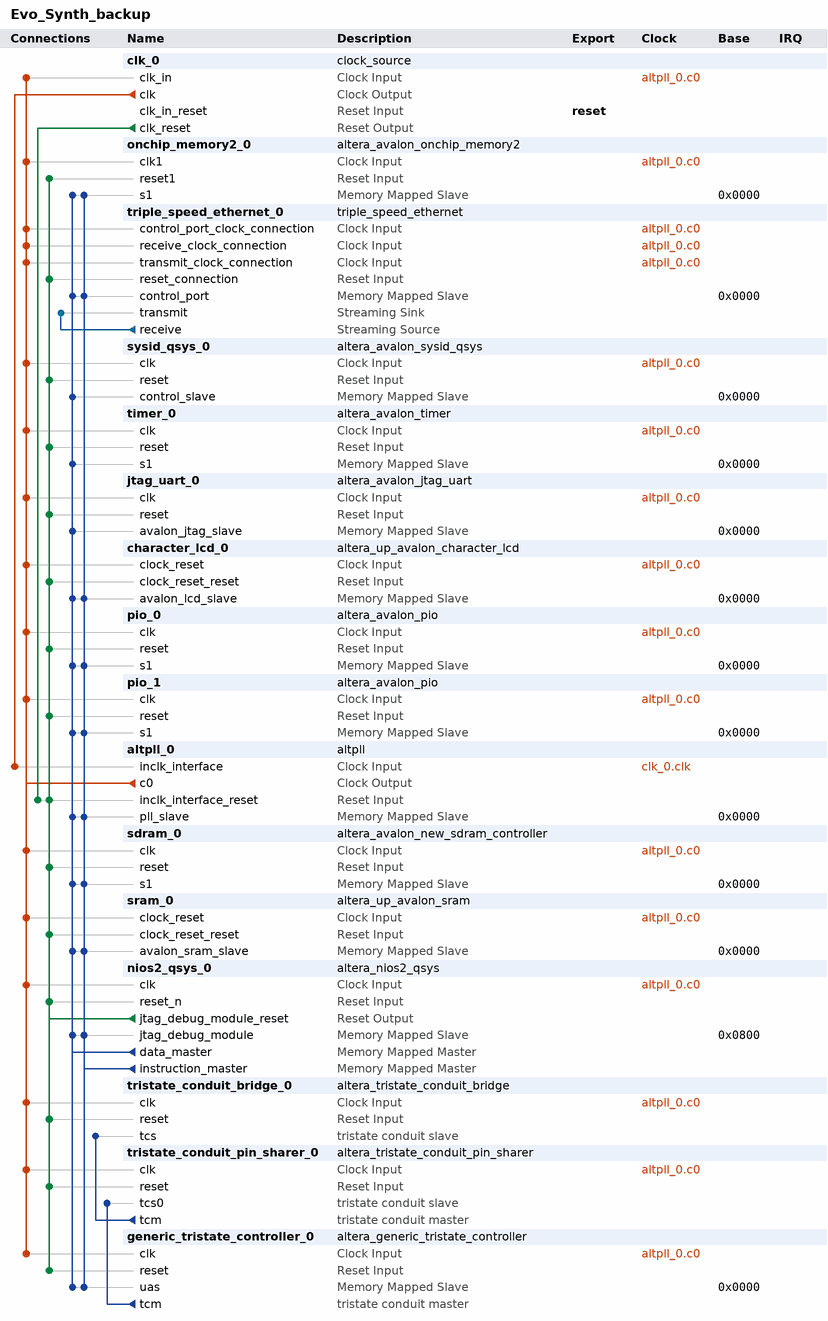
[diagram p0: system contents]
# Platform Designer (Qsys) system Evo_Synth_backup, Cyclone II EP2C35F672C6
# Parameters at their usual value, and those the tool derives, are not listed.
package require -exact qsys 12.1
create_system Evo_Synth_backup
set_project_property DEVICE_FAMILY {Cyclone II}
set_project_property DEVICE EP2C35F672C6

add_instance clk_0 clock_source 12.1
set_instance_parameter_value clk_0 clockFrequency 50000000

add_instance onchip_memory2_0 altera_avalon_onchip_memory2 12.1
set_instance_parameter_value onchip_memory2_0 dataWidth 32
set_instance_parameter_value onchip_memory2_0 dualPort false
set_instance_parameter_value onchip_memory2_0 initMemContent true
set_instance_parameter_value onchip_memory2_0 initializationFileName onchip_memory2_0
set_instance_parameter_value onchip_memory2_0 memorySize 16384

add_instance triple_speed_ethernet_0 triple_speed_ethernet 12.1
set_instance_parameter_value triple_speed_ethernet_0 atlanticSinkClockRate 0
set_instance_parameter_value triple_speed_ethernet_0 atlanticSinkClockSource unassigned
set_instance_parameter_value triple_speed_ethernet_0 atlanticSourceClockRate 0
set_instance_parameter_value triple_speed_ethernet_0 atlanticSourceClockSource unassigned
set_instance_parameter_value triple_speed_ethernet_0 avalonSlaveClockRate 0
set_instance_parameter_value triple_speed_ethernet_0 avalonSlaveClockSource unassigned
set_instance_parameter_value triple_speed_ethernet_0 avalonStNeighbours {unassigned=unassigned}
set_instance_parameter_value triple_speed_ethernet_0 channel_count 1
set_instance_parameter_value triple_speed_ethernet_0 core_variation MAC_ONLY
set_instance_parameter_value triple_speed_ethernet_0 core_version 3073
set_instance_parameter_value triple_speed_ethernet_0 crc32check16bit 0
set_instance_parameter_value triple_speed_ethernet_0 crc32dwidth 8
set_instance_parameter_value triple_speed_ethernet_0 crc32gendelay 6
set_instance_parameter_value triple_speed_ethernet_0 crc32s1l2_extern false
set_instance_parameter_value triple_speed_ethernet_0 cust_version 0
set_instance_parameter_value triple_speed_ethernet_0 dataBitsPerSymbol 8
set_instance_parameter_value triple_speed_ethernet_0 dev_version 3073
set_instance_parameter_value triple_speed_ethernet_0 eg_addr 6
set_instance_parameter_value triple_speed_ethernet_0 ena_hash false
set_instance_parameter_value triple_speed_ethernet_0 enable_alt_reconfig false
set_instance_parameter_value triple_speed_ethernet_0 enable_clk_sharing false
set_instance_parameter_value triple_speed_ethernet_0 enable_ena 32
set_instance_parameter_value triple_speed_ethernet_0 enable_fifoless false
set_instance_parameter_value triple_speed_ethernet_0 enable_gmii_loopback false
set_instance_parameter_value triple_speed_ethernet_0 enable_hd_logic true
set_instance_parameter_value triple_speed_ethernet_0 enable_mac_flow_ctrl false
set_instance_parameter_value triple_speed_ethernet_0 enable_mac_txaddr_set true
set_instance_parameter_value triple_speed_ethernet_0 enable_mac_vlan false
set_instance_parameter_value triple_speed_ethernet_0 enable_maclite false
set_instance_parameter_value triple_speed_ethernet_0 enable_magic_detect true
set_instance_parameter_value triple_speed_ethernet_0 enable_multi_channel false
set_instance_parameter_value triple_speed_ethernet_0 enable_pkt_class true
set_instance_parameter_value triple_speed_ethernet_0 enable_pma false
set_instance_parameter_value triple_speed_ethernet_0 enable_ptp_1step false
set_instance_parameter_value triple_speed_ethernet_0 enable_reg_sharing false
set_instance_parameter_value triple_speed_ethernet_0 enable_sgmii false
set_instance_parameter_value triple_speed_ethernet_0 enable_shift16 true
set_instance_parameter_value triple_speed_ethernet_0 enable_sup_addr false
set_instance_parameter_value triple_speed_ethernet_0 enable_timestamping false
set_instance_parameter_value triple_speed_ethernet_0 enable_use_internal_fifo true
set_instance_parameter_value triple_speed_ethernet_0 export_calblkclk false
set_instance_parameter_value triple_speed_ethernet_0 export_pwrdn false
set_instance_parameter_value triple_speed_ethernet_0 ext_stat_cnt_ena false
set_instance_parameter_value triple_speed_ethernet_0 gigeAdvanceMode true
set_instance_parameter_value triple_speed_ethernet_0 ifGMII MII_GMII
set_instance_parameter_value triple_speed_ethernet_0 ifPCSuseEmbeddedSerdes false
set_instance_parameter_value triple_speed_ethernet_0 ing_addr 11
set_instance_parameter_value triple_speed_ethernet_0 insert_ta true
set_instance_parameter_value triple_speed_ethernet_0 maclite_gige false
set_instance_parameter_value triple_speed_ethernet_0 max_channels 1
set_instance_parameter_value triple_speed_ethernet_0 mdio_clk_div 40
set_instance_parameter_value triple_speed_ethernet_0 phy_identifier 0
set_instance_parameter_value triple_speed_ethernet_0 ramType AUTO
set_instance_parameter_value triple_speed_ethernet_0 reset_level 1
set_instance_parameter_value triple_speed_ethernet_0 starting_channel_number 0
set_instance_parameter_value triple_speed_ethernet_0 stat_cnt_ena true
set_instance_parameter_value triple_speed_ethernet_0 timingAdapterName timingAdapter
set_instance_parameter_value triple_speed_ethernet_0 toolContext SOPC_BUILDER
set_instance_parameter_value triple_speed_ethernet_0 transceiver_type GXB
set_instance_parameter_value triple_speed_ethernet_0 tstamp_fp_width 4
set_instance_parameter_value triple_speed_ethernet_0 uiHostClockFrequency 0
set_instance_parameter_value triple_speed_ethernet_0 uiMDIOFreq {3 MHz}
set_instance_parameter_value triple_speed_ethernet_0 useLvds false
set_instance_parameter_value triple_speed_ethernet_0 useMAC true
set_instance_parameter_value triple_speed_ethernet_0 useMDIO false
set_instance_parameter_value triple_speed_ethernet_0 usePCS false
set_instance_parameter_value triple_speed_ethernet_0 use_sync_reset true

add_instance sysid_qsys_0 altera_avalon_sysid_qsys 12.1
set_instance_parameter_value sysid_qsys_0 id 0

add_instance timer_0 altera_avalon_timer 12.1
set_instance_parameter_value timer_0 period 1
set_instance_parameter_value timer_0 periodUnits MSEC
set_instance_parameter_value timer_0 timerPreset CUSTOM

add_instance jtag_uart_0 altera_avalon_jtag_uart 12.1
set_instance_parameter_value jtag_uart_0 simInteractiveOptions INTERACTIVE_INPUT_OUTPUT

add_instance character_lcd_0 altera_up_avalon_character_lcd 12.0
set_instance_parameter_value character_lcd_0 cursor Normal

add_instance pio_0 altera_avalon_pio 12.1
set_instance_parameter_value pio_0 direction Output
set_instance_parameter_value pio_0 width 8

add_instance pio_1 altera_avalon_pio 12.1
set_instance_parameter_value pio_1 direction Output
set_instance_parameter_value pio_1 width 8

add_instance altpll_0 altpll 12.1
set_instance_parameter_value altpll_0 INCLK0_INPUT_FREQUENCY 20000
set_instance_parameter_value altpll_0 GATE_LOCK_SIGNAL NO
set_instance_parameter_value altpll_0 VALID_LOCK_MULTIPLIER 1
set_instance_parameter_value altpll_0 INVALID_LOCK_MULTIPLIER 5
set_instance_parameter_value altpll_0 CLK0_MULTIPLY_BY 1
set_instance_parameter_value altpll_0 CLK0_DIVIDE_BY 1
set_instance_parameter_value altpll_0 PORT_clk1 PORT_UNUSED
set_instance_parameter_value altpll_0 PORT_clk2 PORT_UNUSED
set_instance_parameter_value altpll_0 PORT_clk3 PORT_UNUSED
set_instance_parameter_value altpll_0 PORT_ARESET PORT_UNUSED
set_instance_parameter_value altpll_0 PORT_LOCKED PORT_UNUSED

add_instance sdram_0 altera_avalon_new_sdram_controller 12.1
set_instance_parameter_value sdram_0 TAC 5.5
set_instance_parameter_value sdram_0 TRCD 20.0
set_instance_parameter_value sdram_0 TRP 20.0
set_instance_parameter_value sdram_0 casLatency 3
set_instance_parameter_value sdram_0 columnWidth 8
set_instance_parameter_value sdram_0 dataWidth 16
set_instance_parameter_value sdram_0 generateSimulationModel false
set_instance_parameter_value sdram_0 model custom
set_instance_parameter_value sdram_0 numberOfBanks 4
set_instance_parameter_value sdram_0 numberOfChipSelects 1
set_instance_parameter_value sdram_0 powerUpDelay 100.0
set_instance_parameter_value sdram_0 refreshPeriod 15.625
set_instance_parameter_value sdram_0 rowWidth 12

add_instance sram_0 altera_up_avalon_sram 12.0
set_instance_parameter_value sram_0 board DE2
set_instance_parameter_value sram_0 pixel_buffer false

add_instance nios2_qsys_0 altera_nios2_qsys 12.1
set_instance_parameter_value nios2_qsys_0 resetSlave generic_tristate_controller_0.uas
set_instance_parameter_value nios2_qsys_0 exceptionSlave None
set_instance_parameter_value nios2_qsys_0 breakSlave nios2_qsys_0.jtag_debug_module
set_instance_parameter_value nios2_qsys_0 impl Tiny
set_instance_parameter_value nios2_qsys_0 icache_size 4096

add_instance tristate_conduit_bridge_0 altera_tristate_conduit_bridge 12.1

add_instance tristate_conduit_pin_sharer_0 altera_tristate_conduit_pin_sharer 12.1
set_instance_parameter_value tristate_conduit_pin_sharer_0 NUM_INTERFACES 1
set_instance_parameter_value tristate_conduit_pin_sharer_0 MODULE_ORIGIN_LIST generic_tristate_controller_0.tcm,generic_tristate_controller_0.tcm,generic_tristate_controller_0.tcm,generic_tristate_controller_0.tcm,generic_tristate_controller_0.tcm

add_instance generic_tristate_controller_0 altera_generic_tristate_controller 12.1
set_instance_parameter_value generic_tristate_controller_0 TCM_ADDRESS_W 22
set_instance_parameter_value generic_tristate_controller_0 TCM_DATA_W 8
set_instance_parameter_value generic_tristate_controller_0 TCM_BYTEENABLE_W 1
set_instance_parameter_value generic_tristate_controller_0 TCM_READ_WAIT 160
set_instance_parameter_value generic_tristate_controller_0 TCM_WRITE_WAIT 160
set_instance_parameter_value generic_tristate_controller_0 TCM_SETUP_WAIT 40
set_instance_parameter_value generic_tristate_controller_0 TCM_DATA_HOLD 40
set_instance_parameter_value generic_tristate_controller_0 TCM_MAX_PENDING_READ_TRANSACTIONS 3
set_instance_parameter_value generic_tristate_controller_0 TCM_TURNAROUND_TIME 2
set_instance_parameter_value generic_tristate_controller_0 TCM_TIMING_UNITS 0
set_instance_parameter_value generic_tristate_controller_0 TCM_READLATENCY 2
set_instance_parameter_value generic_tristate_controller_0 TCM_SYMBOLS_PER_WORD 1
set_instance_parameter_value generic_tristate_controller_0 USE_READ 1
set_instance_parameter_value generic_tristate_controller_0 USE_BEGINTRANSFER 0
set_instance_parameter_value generic_tristate_controller_0 USE_BYTEENABLE 0
set_instance_parameter_value generic_tristate_controller_0 USE_OUTPUTENABLE 0
set_instance_parameter_value generic_tristate_controller_0 ACTIVE_LOW_READ 1
set_instance_parameter_value generic_tristate_controller_0 ACTIVE_LOW_BYTEENABLE 0
set_instance_parameter_value generic_tristate_controller_0 ACTIVE_LOW_OUTPUTENABLE 0
set_instance_parameter_value generic_tristate_controller_0 ACTIVE_LOW_BEGINTRANSFER 0
set_instance_parameter_value generic_tristate_controller_0 CHIPSELECT_THROUGH_READLATENCY 0
set_instance_parameter_value generic_tristate_controller_0 MODULE_ASSIGNMENT_KEYS embeddedsw.configuration.hwClassnameDriverSupportList,embeddedsw.configuration.isFlash,embeddedsw.configuration.isMemoryDevice,embeddedsw.configuration.isNonVolatileStorage
set_instance_parameter_value generic_tristate_controller_0 MODULE_ASSIGNMENT_VALUES "altera_avalon_lan91c111\\,altera_avalon_cfi_flash,1,1,1"
set_instance_parameter_value generic_tristate_controller_0 INTERFACE_ASSIGNMENT_KEYS embeddedsw.configuration.isFlash,embeddedsw.configuration.isMemoryDevice,embeddedsw.configuration.isNonVolatileStorage
set_instance_parameter_value generic_tristate_controller_0 INTERFACE_ASSIGNMENT_VALUES 1,1,1

# connections
add_connection altpll_0.c0 character_lcd_0.clock_reset clock
add_connection altpll_0.c0 clk_0.clk_in clock
add_connection altpll_0.c0 generic_tristate_controller_0.clk clock
add_connection altpll_0.c0 jtag_uart_0.clk clock
add_connection altpll_0.c0 nios2_qsys_0.clk clock
add_connection altpll_0.c0 onchip_memory2_0.clk1 clock
add_connection altpll_0.c0 pio_0.clk clock
add_connection altpll_0.c0 pio_1.clk clock
add_connection altpll_0.c0 sdram_0.clk clock
add_connection altpll_0.c0 sram_0.clock_reset clock
add_connection altpll_0.c0 sysid_qsys_0.clk clock
add_connection altpll_0.c0 timer_0.clk clock
add_connection altpll_0.c0 triple_speed_ethernet_0.control_port_clock_connection clock
add_connection altpll_0.c0 triple_speed_ethernet_0.receive_clock_connection clock
add_connection altpll_0.c0 triple_speed_ethernet_0.transmit_clock_connection clock
add_connection altpll_0.c0 tristate_conduit_bridge_0.clk clock
add_connection altpll_0.c0 tristate_conduit_pin_sharer_0.clk clock
add_connection clk_0.clk altpll_0.inclk_interface clock
add_connection clk_0.clk_reset altpll_0.inclk_interface_reset reset
add_connection nios2_qsys_0.jtag_debug_module_reset altpll_0.inclk_interface_reset reset
add_connection nios2_qsys_0.jtag_debug_module_reset character_lcd_0.clock_reset_reset reset
add_connection nios2_qsys_0.jtag_debug_module_reset generic_tristate_controller_0.reset reset
add_connection nios2_qsys_0.jtag_debug_module_reset jtag_uart_0.reset reset
add_connection nios2_qsys_0.jtag_debug_module_reset nios2_qsys_0.reset_n reset
add_connection nios2_qsys_0.jtag_debug_module_reset onchip_memory2_0.reset1 reset
add_connection nios2_qsys_0.jtag_debug_module_reset pio_0.reset reset
add_connection nios2_qsys_0.jtag_debug_module_reset pio_1.reset reset
add_connection nios2_qsys_0.jtag_debug_module_reset sdram_0.reset reset
add_connection nios2_qsys_0.jtag_debug_module_reset sram_0.clock_reset_reset reset
add_connection nios2_qsys_0.jtag_debug_module_reset sysid_qsys_0.reset reset
add_connection nios2_qsys_0.jtag_debug_module_reset timer_0.reset reset
add_connection nios2_qsys_0.jtag_debug_module_reset triple_speed_ethernet_0.reset_connection reset
add_connection nios2_qsys_0.jtag_debug_module_reset tristate_conduit_bridge_0.reset reset
add_connection nios2_qsys_0.jtag_debug_module_reset tristate_conduit_pin_sharer_0.reset reset
add_connection nios2_qsys_0.data_master altpll_0.pll_slave avalon
set_connection_parameter_value nios2_qsys_0.data_master/altpll_0.pll_slave baseAddress 0x0000
add_connection nios2_qsys_0.data_master character_lcd_0.avalon_lcd_slave avalon
set_connection_parameter_value nios2_qsys_0.data_master/character_lcd_0.avalon_lcd_slave baseAddress 0x0000
add_connection nios2_qsys_0.data_master generic_tristate_controller_0.uas avalon
set_connection_parameter_value nios2_qsys_0.data_master/generic_tristate_controller_0.uas baseAddress 0x0000
add_connection nios2_qsys_0.data_master jtag_uart_0.avalon_jtag_slave avalon
set_connection_parameter_value nios2_qsys_0.data_master/jtag_uart_0.avalon_jtag_slave baseAddress 0x0000
add_connection nios2_qsys_0.data_master nios2_qsys_0.jtag_debug_module avalon
set_connection_parameter_value nios2_qsys_0.data_master/nios2_qsys_0.jtag_debug_module baseAddress 0x0800
add_connection nios2_qsys_0.data_master onchip_memory2_0.s1 avalon
set_connection_parameter_value nios2_qsys_0.data_master/onchip_memory2_0.s1 baseAddress 0x0000
add_connection nios2_qsys_0.data_master pio_0.s1 avalon
set_connection_parameter_value nios2_qsys_0.data_master/pio_0.s1 baseAddress 0x0000
add_connection nios2_qsys_0.data_master pio_1.s1 avalon
set_connection_parameter_value nios2_qsys_0.data_master/pio_1.s1 baseAddress 0x0000
add_connection nios2_qsys_0.data_master sdram_0.s1 avalon
set_connection_parameter_value nios2_qsys_0.data_master/sdram_0.s1 baseAddress 0x0000
add_connection nios2_qsys_0.data_master sram_0.avalon_sram_slave avalon
set_connection_parameter_value nios2_qsys_0.data_master/sram_0.avalon_sram_slave baseAddress 0x0000
add_connection nios2_qsys_0.data_master sysid_qsys_0.control_slave avalon
set_connection_parameter_value nios2_qsys_0.data_master/sysid_qsys_0.control_slave baseAddress 0x0000
add_connection nios2_qsys_0.data_master timer_0.s1 avalon
set_connection_parameter_value nios2_qsys_0.data_master/timer_0.s1 baseAddress 0x0000
add_connection nios2_qsys_0.data_master triple_speed_ethernet_0.control_port avalon
set_connection_parameter_value nios2_qsys_0.data_master/triple_speed_ethernet_0.control_port baseAddress 0x0000
add_connection nios2_qsys_0.instruction_master altpll_0.pll_slave avalon
set_connection_parameter_value nios2_qsys_0.instruction_master/altpll_0.pll_slave baseAddress 0x0000
add_connection nios2_qsys_0.instruction_master character_lcd_0.avalon_lcd_slave avalon
set_connection_parameter_value nios2_qsys_0.instruction_master/character_lcd_0.avalon_lcd_slave baseAddress 0x0000
add_connection nios2_qsys_0.instruction_master generic_tristate_controller_0.uas avalon
set_connection_parameter_value nios2_qsys_0.instruction_master/generic_tristate_controller_0.uas baseAddress 0x0000
add_connection nios2_qsys_0.instruction_master nios2_qsys_0.jtag_debug_module avalon
set_connection_parameter_value nios2_qsys_0.instruction_master/nios2_qsys_0.jtag_debug_module baseAddress 0x0800
add_connection nios2_qsys_0.instruction_master onchip_memory2_0.s1 avalon
set_connection_parameter_value nios2_qsys_0.instruction_master/onchip_memory2_0.s1 baseAddress 0x0000
add_connection nios2_qsys_0.instruction_master pio_0.s1 avalon
set_connection_parameter_value nios2_qsys_0.instruction_master/pio_0.s1 baseAddress 0x0000
add_connection nios2_qsys_0.instruction_master pio_1.s1 avalon
set_connection_parameter_value nios2_qsys_0.instruction_master/pio_1.s1 baseAddress 0x0000
add_connection nios2_qsys_0.instruction_master sdram_0.s1 avalon
set_connection_parameter_value nios2_qsys_0.instruction_master/sdram_0.s1 baseAddress 0x0000
add_connection nios2_qsys_0.instruction_master sram_0.avalon_sram_slave avalon
set_connection_parameter_value nios2_qsys_0.instruction_master/sram_0.avalon_sram_slave baseAddress 0x0000
add_connection nios2_qsys_0.instruction_master triple_speed_ethernet_0.control_port avalon
set_connection_parameter_value nios2_qsys_0.instruction_master/triple_speed_ethernet_0.control_port baseAddress 0x0000
add_connection triple_speed_ethernet_0.receive triple_speed_ethernet_0.transmit avalon_streaming
add_connection generic_tristate_controller_0.tcm tristate_conduit_pin_sharer_0.tcs0 tristate_conduit
add_connection tristate_conduit_pin_sharer_0.tcm tristate_conduit_bridge_0.tcs tristate_conduit

# exported interfaces
add_interface reset reset sink
set_interface_property reset EXPORT_OF clk_0.clk_in_reset

save_system Evo_Synth_backup.qsys
